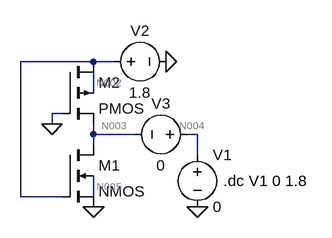
[diagram p0: schematic tut2 Q8.asc]
tut2 Q8.asc, the LTspice schematic file:
Version 4
SHEET 1 880 680
WIRE 304 48 192 48
WIRE 336 48 304 48
WIRE 304 96 304 64
WIRE 256 128 240 128
WIRE 240 144 240 128
WIRE 304 160 304 144
WIRE 368 160 304 160
WIRE 464 160 448 160
WIRE 304 176 304 160
WIRE 464 192 464 160
WIRE 192 256 192 48
WIRE 256 256 192 256
WIRE 304 256 304 224
FLAG 304 272 0
FLAG 240 144 0
FLAG 464 272 0
FLAG 416 48 0
SYMBOL nmos4 256 176 R0
SYMATTR InstName M1
SYMATTR Value2 l=.18 w=5
SYMBOL pmos4 256 48 R0
SYMATTR InstName M2
SYMATTR Value2 l=.18 w=5
SYMBOL voltage 464 176 R0
WINDOW 123 0 0 Left 2
WINDOW 39 0 0 Left 2
SYMATTR InstName V1
SYMATTR Value 0
SYMBOL voltage 320 48 R270
WINDOW 0 32 56 VTop 2
WINDOW 3 -32 56 VBottom 2
WINDOW 123 0 0 Left 2
WINDOW 39 0 0 Left 2
SYMATTR InstName V2
SYMATTR Value 1.8
SYMBOL voltage 464 160 R90
WINDOW 0 -32 56 VBottom 2
WINDOW 3 32 56 VTop 2
WINDOW 123 0 0 Left 2
WINDOW 39 0 0 Left 2
SYMATTR InstName V3
SYMATTR Value 0
TEXT 504 232 Left 2 !.dc V1 0 1.8

The netlist it stands for:
* tut2 Q8.asc
M1 N003 N001 0 N005 NMOS l=.18 w=5
M2 N001 0 N003 N002 PMOS l=.18 w=5
V1 N004 0 0
V2 N001 0 1.8
V3 N004 N003 0
.model NMOS NMOS
.model PMOS PMOS
.lib standard.mos
.dc V1 0 1.8
.backanno
.end

* Results of the author's LTspice run, read from the files saved beside the schematic
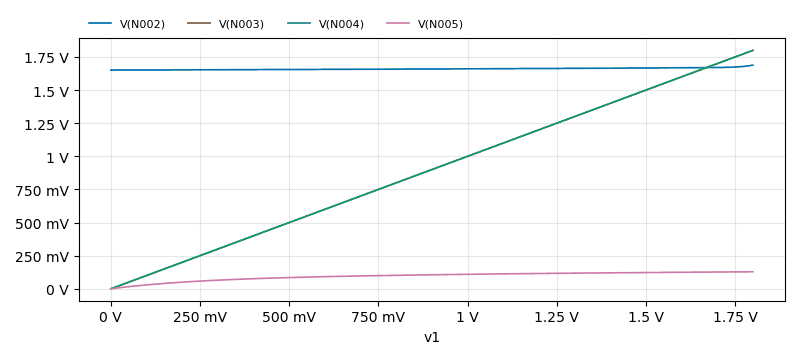
[diagram p1: DC transfer characteristic of tut2 Q8.asc, plotted from the saved traces]
* DC transfer characteristic, 1 run:
*   V(N002): 1.651 V at v1=0 V, 1.689 V at v1=1.8 V, min 1.651 V, max 1.689 V
*   V(N003): 0 V at v1=0 V, 1.8 V at v1=1.8 V, min 0 V, max 1.8 V
*   V(N004): 0 V at v1=0 V, 1.8 V at v1=1.8 V, min 0 V, max 1.8 V
*   V(N005): 2.269e-20 fV at v1=0 V, 128.4 mV at v1=1.8 V, min 2.269e-20 fV, max 128.4 mV